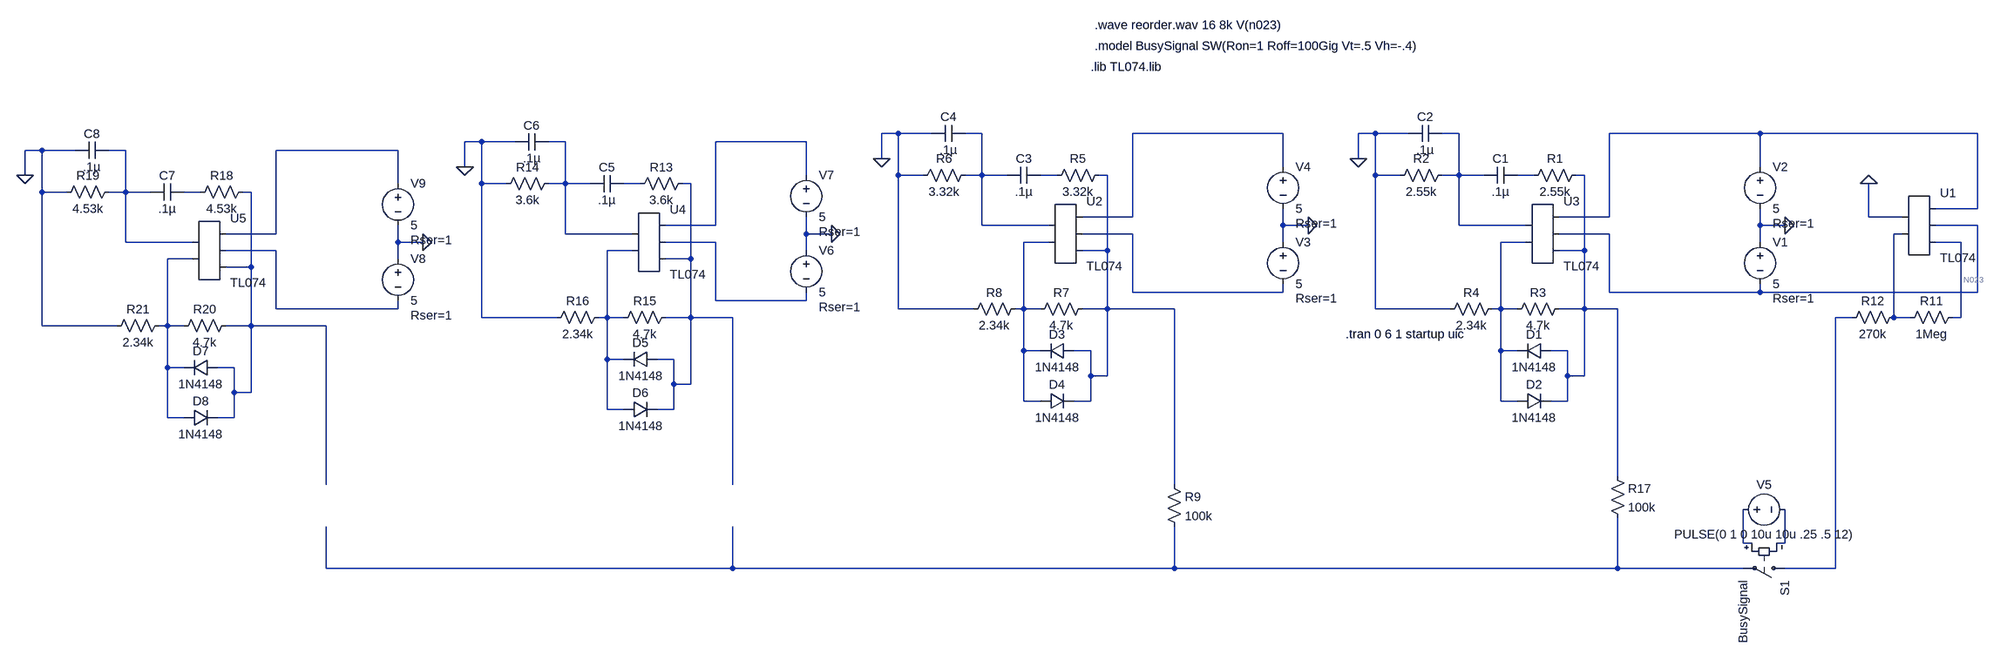
[diagram p0: schematic ToneGenTest.asc]
ToneGenTest.asc, the LTspice schematic file:
Version 4
SHEET 1 880 1040
WIRE -1840 -32 -1872 -32
WIRE -1776 -32 -1840 -32
WIRE -1680 -32 -1712 -32
WIRE -1104 -32 -1392 -32
WIRE -928 -32 -960 -32
WIRE -864 -32 -928 -32
WIRE -768 -32 -800 -32
WIRE -192 -32 -480 -32
WIRE 224 -32 -192 -32
WIRE -2752 -16 -2784 -16
WIRE -2688 -16 -2752 -16
WIRE -2592 -16 -2624 -16
WIRE -2016 -16 -2304 -16
WIRE -3648 0 -3680 0
WIRE -3584 0 -3648 0
WIRE -3488 0 -3520 0
WIRE -2912 0 -3200 0
WIRE -1872 16 -1872 -32
WIRE -960 16 -960 -32
WIRE -2784 32 -2784 -16
WIRE -1104 32 -1104 -32
WIRE -192 32 -192 -32
WIRE -3680 48 -3680 0
WIRE -2016 48 -2016 -16
WIRE -1840 48 -1840 -32
WIRE -1792 48 -1840 48
WIRE -1680 48 -1680 -32
WIRE -1680 48 -1712 48
WIRE -1632 48 -1680 48
WIRE -1536 48 -1568 48
WIRE -1440 48 -1456 48
WIRE -928 48 -928 -32
WIRE -880 48 -928 48
WIRE -768 48 -768 -32
WIRE -768 48 -800 48
WIRE -720 48 -768 48
WIRE -624 48 -656 48
WIRE -528 48 -544 48
WIRE -2912 64 -2912 0
WIRE -2752 64 -2752 -16
WIRE -2704 64 -2752 64
WIRE -2592 64 -2592 -16
WIRE -2592 64 -2624 64
WIRE -2544 64 -2592 64
WIRE -2448 64 -2480 64
WIRE -2352 64 -2368 64
WIRE -3648 80 -3648 0
WIRE -3600 80 -3648 80
WIRE -3488 80 -3488 0
WIRE -3488 80 -3520 80
WIRE -3440 80 -3488 80
WIRE -3344 80 -3376 80
WIRE -3248 80 -3264 80
WIRE 224 112 224 -32
WIRE 224 112 144 112
WIRE -1392 128 -1392 -32
WIRE -1392 128 -1488 128
WIRE -480 128 -480 -32
WIRE -480 128 -576 128
WIRE 16 128 16 64
WIRE 80 128 16 128
WIRE -2304 144 -2304 -16
WIRE -2304 144 -2400 144
WIRE -1680 144 -1680 48
WIRE -1552 144 -1680 144
WIRE -1104 144 -1104 112
WIRE -1056 144 -1104 144
WIRE -768 144 -768 48
WIRE -640 144 -768 144
WIRE -192 144 -192 112
WIRE -144 144 -192 144
WIRE 224 144 144 144
WIRE -3200 160 -3200 0
WIRE -3200 160 -3296 160
WIRE -2592 160 -2592 64
WIRE -2464 160 -2592 160
WIRE -2016 160 -2016 128
WIRE -1968 160 -2016 160
WIRE -1392 160 -1488 160
WIRE -480 160 -576 160
WIRE 80 160 64 160
WIRE -3488 176 -3488 80
WIRE -3360 176 -3488 176
WIRE -2912 176 -2912 144
WIRE -2864 176 -2912 176
WIRE -2304 176 -2400 176
WIRE -1552 176 -1600 176
WIRE -1104 176 -1104 144
WIRE -640 176 -688 176
WIRE -192 176 -192 144
WIRE 192 176 144 176
WIRE -3200 192 -3296 192
WIRE -2464 192 -2512 192
WIRE -2016 192 -2016 160
WIRE -1440 192 -1440 48
WIRE -1440 192 -1488 192
WIRE -528 192 -528 48
WIRE -528 192 -576 192
WIRE -3360 208 -3408 208
WIRE -2912 208 -2912 176
WIRE -2352 208 -2352 64
WIRE -2352 208 -2400 208
WIRE -3248 224 -3248 80
WIRE -3248 224 -3296 224
WIRE -1392 272 -1392 160
WIRE -1104 272 -1104 256
WIRE -1104 272 -1392 272
WIRE -480 272 -480 160
WIRE -192 272 -192 256
WIRE -192 272 -480 272
WIRE 224 272 224 144
WIRE 224 272 -192 272
WIRE -2304 288 -2304 176
WIRE -2016 288 -2016 272
WIRE -2016 288 -2304 288
WIRE -3200 304 -3200 192
WIRE -2912 304 -2912 288
WIRE -2912 304 -3200 304
WIRE -1840 304 -1840 48
WIRE -1696 304 -1840 304
WIRE -1600 304 -1600 176
WIRE -1600 304 -1616 304
WIRE -1568 304 -1600 304
WIRE -1440 304 -1440 192
WIRE -1440 304 -1488 304
WIRE -1312 304 -1440 304
WIRE -928 304 -928 48
WIRE -784 304 -928 304
WIRE -688 304 -688 176
WIRE -688 304 -704 304
WIRE -656 304 -688 304
WIRE -528 304 -528 192
WIRE -528 304 -576 304
WIRE -464 304 -528 304
WIRE -2752 320 -2752 64
WIRE -2608 320 -2752 320
WIRE -2512 320 -2512 192
WIRE -2512 320 -2528 320
WIRE -2480 320 -2512 320
WIRE -2352 320 -2352 208
WIRE -2352 320 -2400 320
WIRE -2272 320 -2352 320
WIRE -16 320 -48 320
WIRE 64 320 64 160
WIRE 96 320 64 320
WIRE 192 320 192 176
WIRE 192 320 176 320
WIRE -3648 336 -3648 80
WIRE -3504 336 -3648 336
WIRE -3408 336 -3408 208
WIRE -3408 336 -3424 336
WIRE -3376 336 -3408 336
WIRE -3248 336 -3248 224
WIRE -3248 336 -3296 336
WIRE -3104 336 -3248 336
WIRE -1600 384 -1600 304
WIRE -1568 384 -1600 384
WIRE -1472 384 -1504 384
WIRE -688 384 -688 304
WIRE -656 384 -688 384
WIRE -560 384 -592 384
WIRE -2512 400 -2512 320
WIRE -2480 400 -2512 400
WIRE -2384 400 -2416 400
WIRE -3408 416 -3408 336
WIRE -3376 416 -3408 416
WIRE -3280 416 -3312 416
WIRE -1472 432 -1472 384
WIRE -1440 432 -1440 304
WIRE -1440 432 -1472 432
WIRE -560 432 -560 384
WIRE -528 432 -528 304
WIRE -528 432 -560 432
WIRE -2384 448 -2384 400
WIRE -2352 448 -2352 320
WIRE -2352 448 -2384 448
WIRE -3280 464 -3280 416
WIRE -3248 464 -3248 336
WIRE -3248 464 -3280 464
WIRE -1600 480 -1600 384
WIRE -1568 480 -1600 480
WIRE -1472 480 -1472 432
WIRE -1472 480 -1504 480
WIRE -688 480 -688 384
WIRE -656 480 -688 480
WIRE -560 480 -560 432
WIRE -560 480 -592 480
WIRE -2512 496 -2512 400
WIRE -2480 496 -2512 496
WIRE -2384 496 -2384 448
WIRE -2384 496 -2416 496
WIRE -3408 512 -3408 416
WIRE -3376 512 -3408 512
WIRE -3280 512 -3280 464
WIRE -3280 512 -3312 512
WIRE -464 624 -464 304
WIRE -3104 640 -3104 336
WIRE -2272 640 -2272 320
WIRE -1312 640 -1312 304
WIRE -224 752 -224 688
WIRE -208 752 -224 752
WIRE -144 752 -144 688
WIRE -144 752 -160 752
WIRE -3104 800 -3104 720
WIRE -2272 800 -2272 720
WIRE -2272 800 -3104 800
WIRE -1312 800 -1312 720
WIRE -1312 800 -2272 800
WIRE -464 800 -464 704
WIRE -464 800 -1312 800
WIRE -224 800 -464 800
WIRE -48 800 -48 320
WIRE -48 800 -144 800
FLAG -144 144 0
FLAG -960 16 0
FLAG -1056 144 0
FLAG -1872 16 0
FLAG 16 64 0
FLAG -1968 160 0
FLAG -2784 32 0
FLAG -2864 176 0
FLAG -3680 48 0
SYMBOL AutoGenerated\\TL074 112 144 R0
SYMATTR InstName U1
SYMBOL voltage -192 160 R0
WINDOW 123 0 0 Left 0
WINDOW 39 24 124 Left 2
SYMATTR SpiceLine Rser=1
SYMATTR InstName V1
SYMATTR Value 5
SYMBOL voltage -192 16 R0
WINDOW 123 0 0 Left 0
WINDOW 39 24 124 Left 2
SYMATTR SpiceLine Rser=1
SYMATTR InstName V2
SYMATTR Value 5
SYMBOL res -528 32 R90
WINDOW 0 0 56 VBottom 2
WINDOW 3 32 56 VTop 2
SYMATTR InstName R1
SYMATTR Value 2.55k
SYMBOL cap -656 32 R90
WINDOW 0 0 32 VBottom 2
WINDOW 3 32 32 VTop 2
SYMATTR InstName C1
SYMATTR Value .1µ
SYMBOL res -784 32 R90
WINDOW 0 0 56 VBottom 2
WINDOW 3 32 56 VTop 2
SYMATTR InstName R2
SYMATTR Value 2.55k
SYMBOL cap -800 -48 R90
WINDOW 0 0 32 VBottom 2
WINDOW 3 32 32 VTop 2
SYMATTR InstName C2
SYMATTR Value .1µ
SYMBOL res -560 288 R90
WINDOW 0 0 56 VBottom 2
WINDOW 3 32 56 VTop 2
SYMATTR InstName R3
SYMATTR Value 4.7k
SYMBOL res -688 288 R90
WINDOW 0 0 56 VBottom 2
WINDOW 3 32 56 VTop 2
SYMATTR InstName R4
SYMATTR Value 2.34k
SYMBOL diode -592 368 R90
WINDOW 0 0 32 VBottom 2
WINDOW 3 32 32 VTop 2
SYMATTR InstName D1
SYMATTR Value 1N4148
SYMBOL diode -656 496 R270
WINDOW 0 32 32 VTop 2
WINDOW 3 0 32 VBottom 2
SYMATTR InstName D2
SYMATTR Value 1N4148
SYMBOL AutoGenerated\\TL074 -1520 160 R0
SYMATTR InstName U2
SYMBOL voltage -1104 160 R0
WINDOW 123 0 0 Left 0
WINDOW 39 24 124 Left 2
SYMATTR SpiceLine Rser=1
SYMATTR InstName V3
SYMATTR Value 5
SYMBOL voltage -1104 16 R0
WINDOW 123 0 0 Left 0
WINDOW 39 24 124 Left 2
SYMATTR SpiceLine Rser=1
SYMATTR InstName V4
SYMATTR Value 5
SYMBOL res -1440 32 R90
WINDOW 0 0 56 VBottom 2
WINDOW 3 32 56 VTop 2
SYMATTR InstName R5
SYMATTR Value 3.32k
SYMBOL cap -1568 32 R90
WINDOW 0 0 32 VBottom 2
WINDOW 3 32 32 VTop 2
SYMATTR InstName C3
SYMATTR Value .1µ
SYMBOL res -1696 32 R90
WINDOW 0 0 56 VBottom 2
WINDOW 3 32 56 VTop 2
SYMATTR InstName R6
SYMATTR Value 3.32k
SYMBOL cap -1712 -48 R90
WINDOW 0 0 32 VBottom 2
WINDOW 3 32 32 VTop 2
SYMATTR InstName C4
SYMATTR Value .1µ
SYMBOL res -1472 288 R90
WINDOW 0 0 56 VBottom 2
WINDOW 3 32 56 VTop 2
SYMATTR InstName R7
SYMATTR Value 4.7k
SYMBOL res -1600 288 R90
WINDOW 0 0 56 VBottom 2
WINDOW 3 32 56 VTop 2
SYMATTR InstName R8
SYMATTR Value 2.34k
SYMBOL diode -1504 368 R90
WINDOW 0 0 32 VBottom 2
WINDOW 3 32 32 VTop 2
SYMATTR InstName D3
SYMATTR Value 1N4148
SYMBOL diode -1568 496 R270
WINDOW 0 32 32 VTop 2
WINDOW 3 0 32 VBottom 2
SYMATTR InstName D4
SYMATTR Value 1N4148
SYMBOL res 192 304 R90
WINDOW 0 0 56 VBottom 2
WINDOW 3 32 56 VTop 2
SYMATTR InstName R11
SYMATTR Value 1Meg
SYMBOL res 80 304 R90
WINDOW 0 0 56 VBottom 2
WINDOW 3 32 56 VTop 2
SYMATTR InstName R12
SYMATTR Value 270k
SYMBOL AutoGenerated\\TL074 -608 160 R0
SYMATTR InstName U3
SYMBOL AutoGenerated\\TL074 -2432 176 R0
SYMATTR InstName U4
SYMBOL voltage -2016 176 R0
WINDOW 123 0 0 Left 0
WINDOW 39 24 124 Left 2
SYMATTR SpiceLine Rser=1
SYMATTR InstName V6
SYMATTR Value 5
SYMBOL voltage -2016 32 R0
WINDOW 123 0 0 Left 0
WINDOW 39 24 124 Left 2
SYMATTR SpiceLine Rser=1
SYMATTR InstName V7
SYMATTR Value 5
SYMBOL res -2352 48 R90
WINDOW 0 0 56 VBottom 2
WINDOW 3 32 56 VTop 2
SYMATTR InstName R13
SYMATTR Value 3.6k
SYMBOL cap -2480 48 R90
WINDOW 0 0 32 VBottom 2
WINDOW 3 32 32 VTop 2
SYMATTR InstName C5
SYMATTR Value .1µ
SYMBOL res -2608 48 R90
WINDOW 0 0 56 VBottom 2
WINDOW 3 32 56 VTop 2
SYMATTR InstName R14
SYMATTR Value 3.6k
SYMBOL cap -2624 -32 R90
WINDOW 0 0 32 VBottom 2
WINDOW 3 32 32 VTop 2
SYMATTR InstName C6
SYMATTR Value .1µ
SYMBOL res -2384 304 R90
WINDOW 0 0 56 VBottom 2
WINDOW 3 32 56 VTop 2
SYMATTR InstName R15
SYMATTR Value 4.7k
SYMBOL res -2512 304 R90
WINDOW 0 0 56 VBottom 2
WINDOW 3 32 56 VTop 2
SYMATTR InstName R16
SYMATTR Value 2.34k
SYMBOL diode -2416 384 R90
WINDOW 0 0 32 VBottom 2
WINDOW 3 32 32 VTop 2
SYMATTR InstName D5
SYMATTR Value 1N4148
SYMBOL diode -2480 512 R270
WINDOW 0 32 32 VTop 2
WINDOW 3 0 32 VBottom 2
SYMATTR InstName D6
SYMATTR Value 1N4148
SYMBOL res -480 608 R0
SYMATTR InstName R17
SYMATTR Value 100k
SYMBOL AutoGenerated\\TL074 -3328 192 R0
SYMATTR InstName U5
SYMBOL voltage -2912 192 R0
WINDOW 123 0 0 Left 0
WINDOW 39 24 124 Left 2
SYMATTR SpiceLine Rser=1
SYMATTR InstName V8
SYMATTR Value 5
SYMBOL voltage -2912 48 R0
WINDOW 123 0 0 Left 0
WINDOW 39 24 124 Left 2
SYMATTR SpiceLine Rser=1
SYMATTR InstName V9
SYMATTR Value 5
SYMBOL res -3248 64 R90
WINDOW 0 0 56 VBottom 2
WINDOW 3 32 56 VTop 2
SYMATTR InstName R18
SYMATTR Value 4.53k
SYMBOL cap -3376 64 R90
WINDOW 0 0 32 VBottom 2
WINDOW 3 32 32 VTop 2
SYMATTR InstName C7
SYMATTR Value .1µ
SYMBOL res -3504 64 R90
WINDOW 0 0 56 VBottom 2
WINDOW 3 32 56 VTop 2
SYMATTR InstName R19
SYMATTR Value 4.53k
SYMBOL cap -3520 -16 R90
WINDOW 0 0 32 VBottom 2
WINDOW 3 32 32 VTop 2
SYMATTR InstName C8
SYMATTR Value .1µ
SYMBOL res -3280 320 R90
WINDOW 0 0 56 VBottom 2
WINDOW 3 32 56 VTop 2
SYMATTR InstName R20
SYMATTR Value 4.7k
SYMBOL res -3408 320 R90
WINDOW 0 0 56 VBottom 2
WINDOW 3 32 56 VTop 2
SYMATTR InstName R21
SYMATTR Value 2.34k
SYMBOL diode -3312 400 R90
WINDOW 0 0 32 VBottom 2
WINDOW 3 32 32 VTop 2
SYMATTR InstName D7
SYMATTR Value 1N4148
SYMBOL diode -3376 528 R270
WINDOW 0 32 32 VTop 2
WINDOW 3 0 32 VBottom 2
SYMATTR InstName D8
SYMATTR Value 1N4148
SYMBOL res -1328 624 R0
SYMATTR InstName R9
SYMATTR Value 100k
SYMBOL sw -128 800 R90
SYMATTR InstName S1
SYMATTR Value BusySignal
SYMBOL voltage -240 688 R270
WINDOW 0 32 56 VTop 2
WINDOW 3 -32 56 VBottom 2
WINDOW 123 0 0 Left 0
WINDOW 39 0 0 Left 0
SYMATTR InstName V5
SYMATTR Value PULSE(0 1 0 10u 10u .25 .5 12)
TEXT -1472 -160 Left 2 !.lib TL074.lib
TEXT -984 352 Left 2 !.tran 0 6 1 startup uic
TEXT -1464 -240 Left 2 !.wave reorder.wav 16 8k V(n023)
TEXT -1464 -200 Left 2 !.model BusySignal SW(Ron=1 Roff=100Gig Vt=.5 Vh=-.4)

The netlist it stands for:
* ToneGenTest.asc
* U1: TL074 (symbol AutoGenerated\TL074 not available, pins judged from their places): pin1=0 pin2=N019 pin3=N004 pin4=N017 pin5=N023
V1 0 N017 5 Rser=1
V2 N004 0 5 Rser=1
R1 N012 N011 2.55k
C1 N011 N003 .1µ
R2 N003 0 2.55k
C2 N003 0 .1µ
R3 N012 N022 4.7k
R4 N022 0 2.34k
D1 N012 N022 1N4148
D2 N022 N012 1N4148
* U2: TL074 (symbol AutoGenerated\TL074 not available, pins judged from their places): pin1=N001 pin2=N021 pin3=N002 pin4=N018 pin5=N010
V3 0 N018 5 Rser=1
V4 N002 0 5 Rser=1
R5 N010 N009 3.32k
C3 N009 N001 .1µ
R6 N001 0 3.32k
C4 N001 0 .1µ
R7 N010 N021 4.7k
R8 N021 0 2.34k
D3 N010 N021 1N4148
D4 N021 N010 1N4148
R11 N023 N019 1Meg
R12 N019 N027 270k
* U3: TL074 (symbol AutoGenerated\TL074 not available, pins judged from their places): pin1=N003 pin2=N022 pin3=N004 pin4=N017 pin5=N012
* U4: TL074 (symbol AutoGenerated\TL074 not available, pins judged from their places): pin1=N005 pin2=N025 pin3=N006 pin4=N020 pin5=N014
V6 0 N020 5 Rser=1
V7 N006 0 5 Rser=1
R13 N014 N013 3.6k
C5 N013 N005 .1µ
R14 N005 0 3.6k
C6 N005 0 .1µ
R15 N014 N025 4.7k
R16 N025 0 2.34k
D5 N014 N025 1N4148
D6 N025 N014 1N4148
R17 N012 N030 100k
* U5: TL074 (symbol AutoGenerated\TL074 not available, pins judged from their places): pin1=N007 pin2=N026 pin3=N008 pin4=N024 pin5=N016
V8 0 N024 5 Rser=1
V9 N008 0 5 Rser=1
R18 N016 N015 4.53k
C7 N015 N007 .1µ
R19 N007 0 4.53k
C8 N007 0 .1µ
R20 N016 N026 4.7k
R21 N026 0 2.34k
D7 N016 N026 1N4148
D8 N026 N016 1N4148
R9 N010 N030 100k
S1 N027 N030 N028 N029 BusySignal
V5 N028 N029 PULSE(0 1 0 10u 10u .25 .5 12)
.model D D
.lib standard.dio
.lib TL074.lib
.tran 0 6 1 startup uic
.wave reorder.wav 16 8k V(n023)
.model BusySignal SW(Ron=1 Roff=100Gig Vt=.5 Vh=-.4)
.backanno
.end